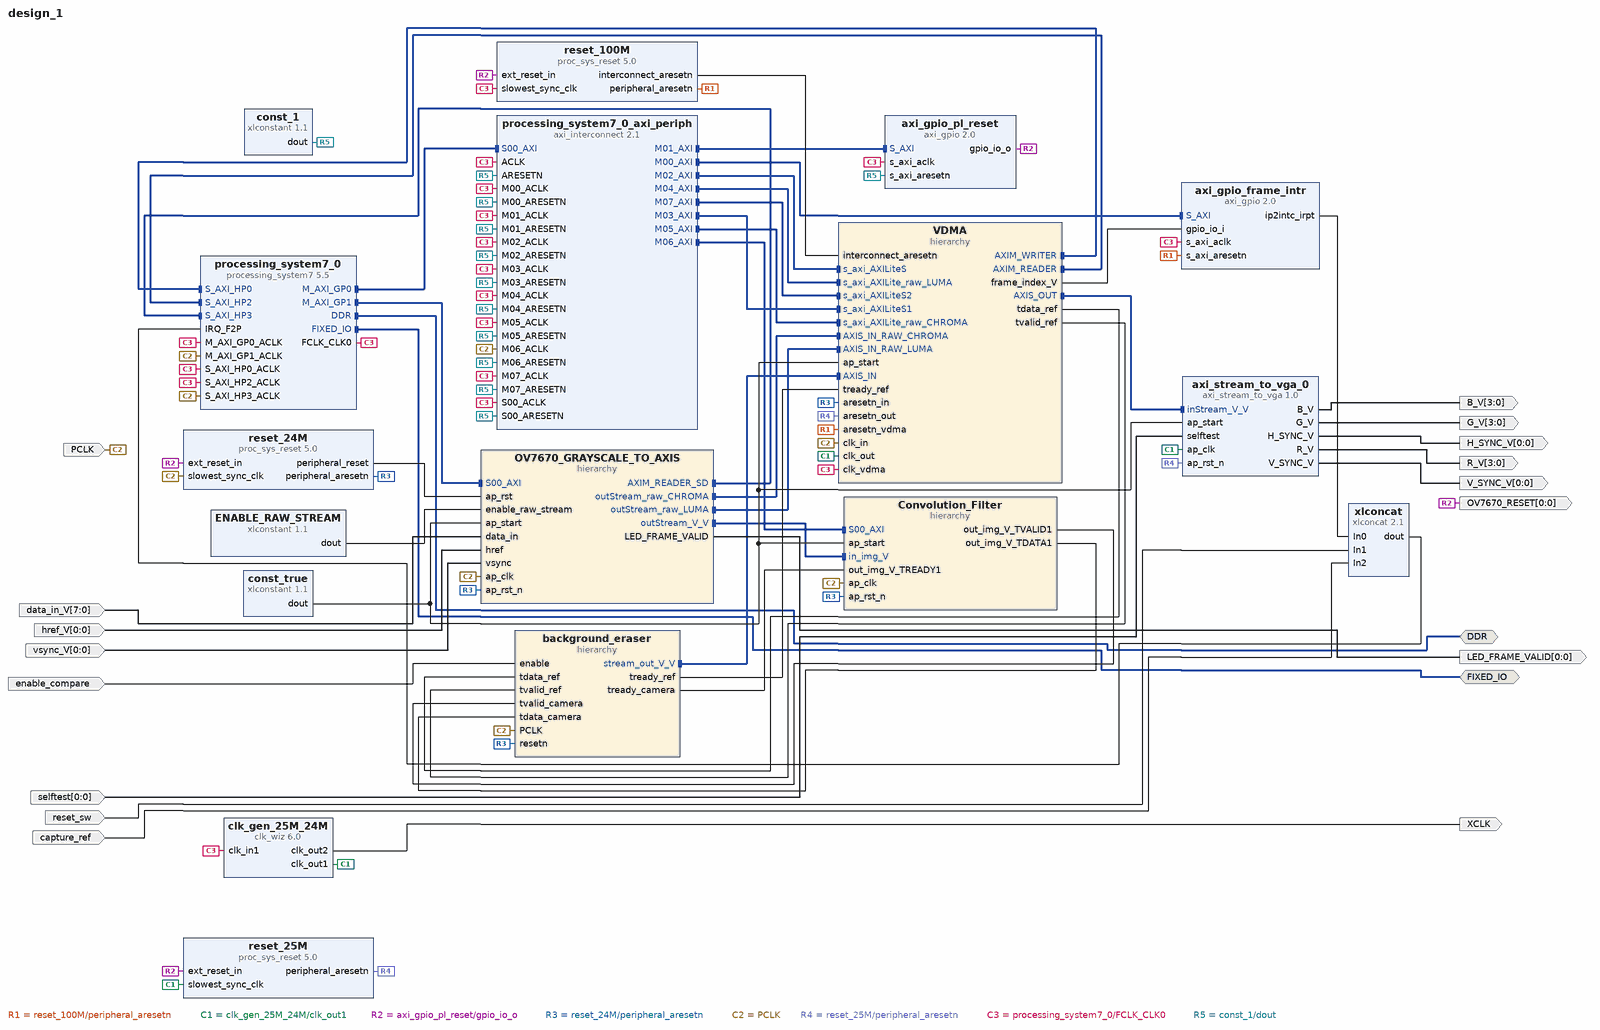
[diagram p0: block diagram of the top level]
# Vivado block design design_1, xc7z020clg484-1, Vivado 2019.1
create_bd_design design_1

create_bd_intf_port -mode Master -vlnv xilinx.com:interface:ddrx_rtl:1.0 DDR
create_bd_intf_port -mode Master -vlnv xilinx.com:display_processing_system7:fixedio_rtl:1.0 FIXED_IO
create_bd_port -dir O -from 0 -to 0 -type rst OV7670_RESET
create_bd_port -dir O -type clk XCLK
create_bd_port -dir I -type clk PCLK
set_property -dict {CONFIG.FREQ_HZ 24000000} [get_bd_ports PCLK]
create_bd_port -dir O -from 3 -to 0 -type data R_V
create_bd_port -dir O -from 3 -to 0 -type data G_V
create_bd_port -dir O -from 3 -to 0 -type data B_V
create_bd_port -dir O -from 0 -to 0 -type data V_SYNC_V
create_bd_port -dir O -from 0 -to 0 -type data H_SYNC_V
create_bd_port -dir I -from 0 -to 0 -type data selftest
set_property -dict [list \
  CONFIG.LAYERED_METADATA {xilinx.com:interface:datatypes:1.0 {DATA {datatype {name {attribs {resolve_type immediate dependency {} format string minimum {} maximum {}} value {}} bitwidth {attribs {resolve_type immediate dependency {} format long minimum {} maximum {}} value 1} bitoffset {attribs {resolve_type immediate dependency {} format long minimum {} maximum {}} value 0}}}}} \
] [get_bd_ports selftest]
create_bd_port -dir I -from 7 -to 0 -type data data_in_V
set_property -dict [list \
  CONFIG.LAYERED_METADATA {xilinx.com:interface:datatypes:1.0 {DATA {datatype {name {attribs {resolve_type immediate dependency {} format string minimum {} maximum {}} value {}} bitwidth {attribs {resolve_type immediate dependency {} format long minimum {} maximum {}} value 8} bitoffset {attribs {resolve_type immediate dependency {} format long minimum {} maximum {}} value 0} integer {signed {attribs {resolve_type immediate dependency {} format bool minimum {} maximum {}} value false}}}}}} \
] [get_bd_ports data_in_V]
create_bd_port -dir I -from 0 -to 0 -type data href_V
set_property -dict [list \
  CONFIG.LAYERED_METADATA {xilinx.com:interface:datatypes:1.0 {DATA {datatype {name {attribs {resolve_type immediate dependency {} format string minimum {} maximum {}} value {}} bitwidth {attribs {resolve_type immediate dependency {} format long minimum {} maximum {}} value 1} bitoffset {attribs {resolve_type immediate dependency {} format long minimum {} maximum {}} value 0} integer {signed {attribs {resolve_type immediate dependency {} format bool minimum {} maximum {}} value false}}}}}} \
] [get_bd_ports href_V]
create_bd_port -dir I -from 0 -to 0 -type data vsync_V
set_property -dict [list \
  CONFIG.LAYERED_METADATA {xilinx.com:interface:datatypes:1.0 {DATA {datatype {name {attribs {resolve_type immediate dependency {} format string minimum {} maximum {}} value {}} bitwidth {attribs {resolve_type immediate dependency {} format long minimum {} maximum {}} value 1} bitoffset {attribs {resolve_type immediate dependency {} format long minimum {} maximum {}} value 0} integer {signed {attribs {resolve_type immediate dependency {} format bool minimum {} maximum {}} value false}}}}}} \
] [get_bd_ports vsync_V]
create_bd_port -dir I -type intr reset_sw
create_bd_port -dir O -from 0 -to 0 -type data LED_FRAME_VALID
create_bd_port -dir I -type data enable_compare
create_bd_port -dir I -type intr capture_ref

create_bd_cell -type hier VDMA
create_bd_cell -type hier OV7670_GRAYSCALE_TO_AXIS
create_bd_cell -type ip -vlnv xilinx.com:hls:axi_stream_to_vga:1.0 axi_stream_to_vga_0
create_bd_cell -type hier Convolution_Filter
create_bd_cell -type ip -vlnv xilinx.com:ip:axi_gpio:2.0 axi_gpio_frame_intr
set_property -dict {CONFIG.C_ALL_INPUTS 1 CONFIG.C_GPIO_WIDTH 8 CONFIG.C_INTERRUPT_PRESENT 1} [get_bd_cells axi_gpio_frame_intr]
create_bd_cell -type ip -vlnv xilinx.com:ip:axi_gpio:2.0 axi_gpio_pl_reset
set_property -dict [list \
  CONFIG.C_ALL_OUTPUTS 1 \
  CONFIG.C_DOUT_DEFAULT 0x00000001 \
  CONFIG.C_GPIO_WIDTH 1 \
] [get_bd_cells axi_gpio_pl_reset]
create_bd_cell -type ip -vlnv xilinx.com:ip:clk_wiz:6.0 clk_gen_25M_24M
set_property -dict [list \
  CONFIG.CLKOUT1_JITTER 469.645 \
  CONFIG.CLKOUT1_PHASE_ERROR 476.991 \
  CONFIG.CLKOUT1_REQUESTED_OUT_FREQ 25.175 \
  CONFIG.CLKOUT2_JITTER 473.605 \
  CONFIG.CLKOUT2_PHASE_ERROR 476.991 \
  CONFIG.CLKOUT2_REQUESTED_OUT_FREQ 24 \
  CONFIG.CLKOUT2_USED true \
  CONFIG.MMCM_CLKFBOUT_MULT_F 53.750 \
  CONFIG.MMCM_CLKIN1_PERIOD 10.000 \
  CONFIG.MMCM_CLKIN2_PERIOD 10.000 \
  CONFIG.MMCM_CLKOUT0_DIVIDE_F 30.500 \
  CONFIG.MMCM_CLKOUT1_DIVIDE 32 \
  CONFIG.MMCM_DIVCLK_DIVIDE 7 \
  CONFIG.NUM_OUT_CLKS 2 \
  CONFIG.USE_LOCKED false \
  CONFIG.USE_RESET false \
] [get_bd_cells clk_gen_25M_24M]
create_bd_cell -type ip -vlnv xilinx.com:ip:proc_sys_reset:5.0 reset_25M
create_bd_cell -type ip -vlnv xilinx.com:ip:proc_sys_reset:5.0 reset_24M
create_bd_cell -type ip -vlnv xilinx.com:ip:processing_system7:5.5 processing_system7_0
set_property -dict [list \
  CONFIG.PCW_APU_PERIPHERAL_FREQMHZ 666.666667 \
  CONFIG.PCW_ENET0_ENET0_IO {MIO 16 .. 27} \
  CONFIG.PCW_ENET0_GRP_MDIO_ENABLE 1 \
  CONFIG.PCW_ENET0_GRP_MDIO_IO {MIO 52 .. 53} \
  CONFIG.PCW_ENET0_PERIPHERAL_ENABLE 1 \
  CONFIG.PCW_ENET0_RESET_ENABLE 0 \
  CONFIG.PCW_ENET_RESET_ENABLE 1 \
  CONFIG.PCW_ENET_RESET_SELECT {Share reset pin} \
  CONFIG.PCW_FPGA0_PERIPHERAL_FREQMHZ 100.000000 \
  CONFIG.PCW_FPGA1_PERIPHERAL_FREQMHZ 150.000000 \
  CONFIG.PCW_GP0_EN_MODIFIABLE_TXN 0 \
  CONFIG.PCW_GP1_EN_MODIFIABLE_TXN 0 \
  CONFIG.PCW_GPIO_MIO_GPIO_ENABLE 1 \
  CONFIG.PCW_GPIO_MIO_GPIO_IO MIO \
  CONFIG.PCW_I2C0_GRP_INT_ENABLE 0 \
  CONFIG.PCW_I2C0_I2C0_IO {MIO 10 .. 11} \
  CONFIG.PCW_I2C0_PERIPHERAL_ENABLE 1 \
  CONFIG.PCW_I2C_PERIPHERAL_FREQMHZ 111.111115 \
  CONFIG.PCW_I2C_RESET_ENABLE 1 \
  CONFIG.PCW_I2C_RESET_SELECT {Share reset pin} \
  CONFIG.PCW_IRQ_F2P_INTR 1 \
  CONFIG.PCW_PERIPHERAL_BOARD_PRESET part0 \
  CONFIG.PCW_PRESET_BANK1_VOLTAGE {LVCMOS 1.8V} \
  CONFIG.PCW_QSPI_GRP_SINGLE_SS_ENABLE 1 \
  CONFIG.PCW_QSPI_GRP_SINGLE_SS_IO {MIO 1 .. 6} \
  CONFIG.PCW_QSPI_PERIPHERAL_ENABLE 1 \
  CONFIG.PCW_QSPI_QSPI_IO {MIO 1 .. 6} \
  CONFIG.PCW_SD0_GRP_CD_ENABLE 1 \
  CONFIG.PCW_SD0_GRP_CD_IO {MIO 47} \
  CONFIG.PCW_SD0_GRP_WP_ENABLE 1 \
  CONFIG.PCW_SD0_GRP_WP_IO {MIO 46} \
  CONFIG.PCW_SD0_PERIPHERAL_ENABLE 1 \
  CONFIG.PCW_SD0_SD0_IO {MIO 40 .. 45} \
  CONFIG.PCW_SDIO_PERIPHERAL_FREQMHZ 50 \
  CONFIG.PCW_SINGLE_QSPI_DATA_MODE x4 \
  CONFIG.PCW_TTC0_PERIPHERAL_ENABLE 1 \
  CONFIG.PCW_TTC0_TTC0_IO EMIO \
  CONFIG.PCW_UART1_PERIPHERAL_ENABLE 1 \
  CONFIG.PCW_UART1_UART1_IO {MIO 48 .. 49} \
  CONFIG.PCW_UART_PERIPHERAL_FREQMHZ 50 \
  CONFIG.PCW_UIPARAM_DDR_FREQ_MHZ 533.333313 \
  CONFIG.PCW_UIPARAM_DDR_PARTNO {MT41J128M16 HA-15E} \
  CONFIG.PCW_USB0_PERIPHERAL_ENABLE 1 \
  CONFIG.PCW_USB0_RESET_ENABLE 0 \
  CONFIG.PCW_USB0_USB0_IO {MIO 28 .. 39} \
  CONFIG.PCW_USB_RESET_ENABLE 1 \
  CONFIG.PCW_USB_RESET_SELECT {Share reset pin} \
  CONFIG.PCW_USE_FABRIC_INTERRUPT 1 \
  CONFIG.PCW_USE_M_AXI_GP1 1 \
  CONFIG.PCW_USE_S_AXI_HP0 1 \
  CONFIG.PCW_USE_S_AXI_HP2 1 \
  CONFIG.PCW_USE_S_AXI_HP3 1 \
  CONFIG.preset ZedBoard \
] [get_bd_cells processing_system7_0]
# 536 more settings of processing_system7_0 are not shown: defaults, MIO pin electricals, DDR timing, and values the tool derives
create_bd_cell -type ip -vlnv xilinx.com:ip:axi_interconnect:2.1 processing_system7_0_axi_periph
set_property -dict {CONFIG.NUM_MI 8 CONFIG.SYNCHRONIZATION_STAGES 2} [get_bd_cells processing_system7_0_axi_periph]
create_bd_cell -type ip -vlnv xilinx.com:ip:proc_sys_reset:5.0 reset_100M
create_bd_cell -type ip -vlnv xilinx.com:ip:xlconcat:2.1 xlconcat
set_property -dict {CONFIG.NUM_PORTS 3} [get_bd_cells xlconcat]
create_bd_cell -type ip -vlnv xilinx.com:ip:xlconstant:1.1 const_true
create_bd_cell -type ip -vlnv xilinx.com:ip:xlconstant:1.1 const_1
create_bd_cell -type ip -vlnv xilinx.com:ip:xlconstant:1.1 ENABLE_RAW_STREAM
set_property -dict {CONFIG.CONST_VAL 1} [get_bd_cells ENABLE_RAW_STREAM]
create_bd_cell -type hier background_eraser

# ---- hierarchy /VDMA ----
current_bd_instance /VDMA
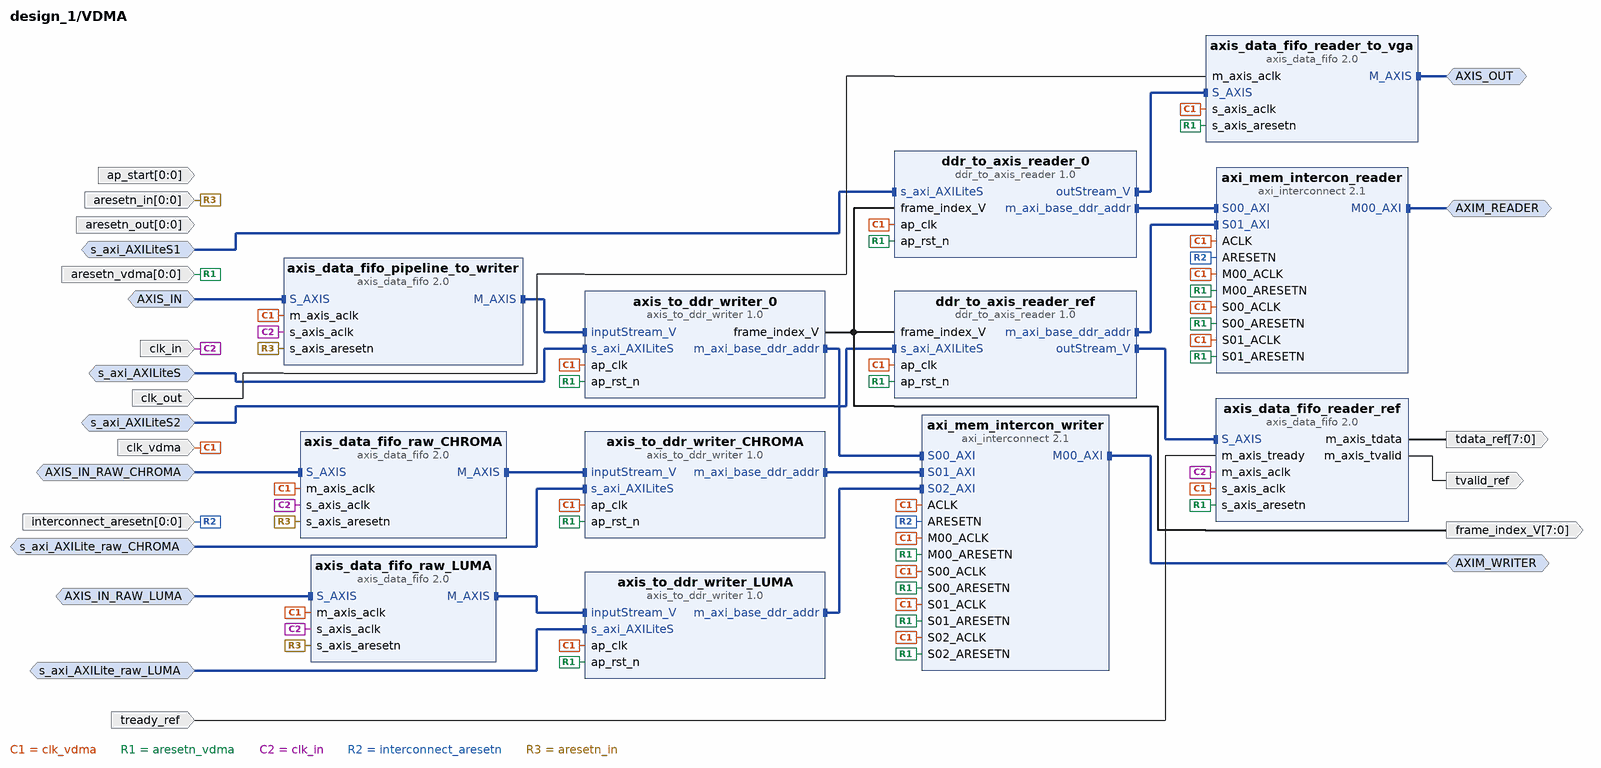
[diagram p1: block diagram inside /VDMA]
create_bd_intf_pin -mode Slave -vlnv xilinx.com:interface:axis_rtl:1.0 AXIS_IN
create_bd_intf_pin -mode Master -vlnv xilinx.com:interface:aximm_rtl:1.0 AXIM_READER
create_bd_intf_pin -mode Master -vlnv xilinx.com:interface:aximm_rtl:1.0 AXIM_WRITER
create_bd_intf_pin -mode Slave -vlnv xilinx.com:interface:aximm_rtl:1.0 s_axi_AXILiteS
create_bd_intf_pin -mode Slave -vlnv xilinx.com:interface:aximm_rtl:1.0 s_axi_AXILiteS1
create_bd_intf_pin -mode Slave -vlnv xilinx.com:interface:aximm_rtl:1.0 s_axi_AXILite_raw_LUMA
create_bd_intf_pin -mode Slave -vlnv xilinx.com:interface:aximm_rtl:1.0 s_axi_AXILite_raw_CHROMA
create_bd_intf_pin -mode Slave -vlnv xilinx.com:interface:axis_rtl:1.0 AXIS_IN_RAW_LUMA
create_bd_intf_pin -mode Slave -vlnv xilinx.com:interface:axis_rtl:1.0 AXIS_IN_RAW_CHROMA
create_bd_intf_pin -mode Master -vlnv xilinx.com:interface:axis_rtl:1.0 AXIS_OUT
create_bd_intf_pin -mode Slave -vlnv xilinx.com:interface:aximm_rtl:1.0 s_axi_AXILiteS2
create_bd_pin -dir I -type clk clk_vdma
create_bd_pin -dir I -from 0 -to 0 -type rst aresetn_vdma
create_bd_pin -dir I -from 0 -to 0 ap_start
create_bd_pin -dir I -from 0 -to 0 -type rst aresetn_in
create_bd_pin -dir I -type clk clk_in
create_bd_pin -dir I -from 0 -to 0 -type rst interconnect_aresetn
create_bd_pin -dir O -from 7 -to 0 -type data frame_index_V
create_bd_pin -dir I -type clk clk_out
create_bd_pin -dir I -from 0 -to 0 -type rst aresetn_out
create_bd_pin -dir O -from 7 -to 0 tdata_ref
create_bd_pin -dir O tvalid_ref
create_bd_pin -dir I tready_ref

create_bd_cell -type ip -vlnv xilinx.com:hls:ddr_to_axis_reader:1.0 ddr_to_axis_reader_0
create_bd_cell -type ip -vlnv xilinx.com:ip:axi_interconnect:2.1 axi_mem_intercon_writer
set_property -dict {CONFIG.NUM_MI 1 CONFIG.NUM_SI 3 CONFIG.SYNCHRONIZATION_STAGES 2} [get_bd_cells axi_mem_intercon_writer]
create_bd_cell -type ip -vlnv xilinx.com:ip:axi_interconnect:2.1 axi_mem_intercon_reader
set_property -dict {CONFIG.NUM_MI 1 CONFIG.NUM_SI 2 CONFIG.SYNCHRONIZATION_STAGES 2} [get_bd_cells axi_mem_intercon_reader]
create_bd_cell -type ip -vlnv xilinx.com:ip:axis_data_fifo:2.0 axis_data_fifo_reader_to_vga
set_property -dict [list \
  CONFIG.FIFO_DEPTH 1024 \
  CONFIG.HAS_RD_DATA_COUNT 1 \
  CONFIG.HAS_WR_DATA_COUNT 1 \
  CONFIG.IS_ACLK_ASYNC 1 \
  CONFIG.SYNCHRONIZATION_STAGES 2 \
] [get_bd_cells axis_data_fifo_reader_to_vga]
create_bd_cell -type ip -vlnv xilinx.com:ip:axis_data_fifo:2.0 axis_data_fifo_raw_LUMA
set_property -dict [list \
  CONFIG.FIFO_DEPTH 1024 \
  CONFIG.HAS_RD_DATA_COUNT 1 \
  CONFIG.HAS_WR_DATA_COUNT 1 \
  CONFIG.IS_ACLK_ASYNC 1 \
  CONFIG.SYNCHRONIZATION_STAGES 2 \
] [get_bd_cells axis_data_fifo_raw_LUMA]
create_bd_cell -type ip -vlnv xilinx.com:ip:axis_data_fifo:2.0 axis_data_fifo_pipeline_to_writer
set_property -dict [list \
  CONFIG.FIFO_DEPTH 1024 \
  CONFIG.HAS_RD_DATA_COUNT 1 \
  CONFIG.HAS_WR_DATA_COUNT 1 \
  CONFIG.IS_ACLK_ASYNC 1 \
  CONFIG.SYNCHRONIZATION_STAGES 2 \
] [get_bd_cells axis_data_fifo_pipeline_to_writer]
create_bd_cell -type ip -vlnv xilinx.com:ip:axis_data_fifo:2.0 axis_data_fifo_raw_CHROMA
set_property -dict [list \
  CONFIG.FIFO_DEPTH 1024 \
  CONFIG.HAS_RD_DATA_COUNT 1 \
  CONFIG.HAS_WR_DATA_COUNT 1 \
  CONFIG.IS_ACLK_ASYNC 1 \
  CONFIG.SYNCHRONIZATION_STAGES 2 \
] [get_bd_cells axis_data_fifo_raw_CHROMA]
create_bd_cell -type ip -vlnv xilinx.com:hls:ddr_to_axis_reader:1.0 ddr_to_axis_reader_ref
create_bd_cell -type ip -vlnv xilinx.com:ip:axis_data_fifo:2.0 axis_data_fifo_reader_ref
set_property -dict [list \
  CONFIG.FIFO_DEPTH 1024 \
  CONFIG.HAS_RD_DATA_COUNT 1 \
  CONFIG.HAS_WR_DATA_COUNT 1 \
  CONFIG.IS_ACLK_ASYNC 1 \
  CONFIG.SYNCHRONIZATION_STAGES 2 \
] [get_bd_cells axis_data_fifo_reader_ref]
create_bd_cell -type ip -vlnv xilinx.com:hls:axis_to_ddr_writer:1.0 axis_to_ddr_writer_0
create_bd_cell -type ip -vlnv xilinx.com:hls:axis_to_ddr_writer:1.0 axis_to_ddr_writer_CHROMA
create_bd_cell -type ip -vlnv xilinx.com:hls:axis_to_ddr_writer:1.0 axis_to_ddr_writer_LUMA

# ---- hierarchy /OV7670_GRAYSCALE_TO_AXIS ----
current_bd_instance /OV7670_GRAYSCALE_TO_AXIS
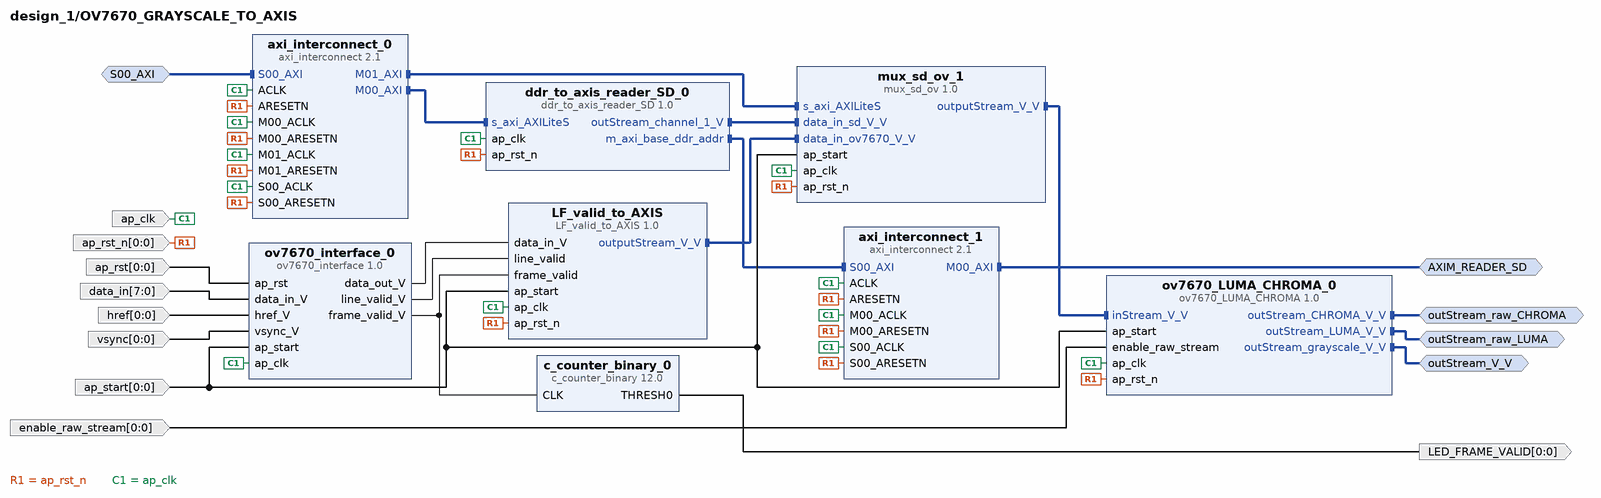
[diagram p2: block diagram inside /OV7670_GRAYSCALE_TO_AXIS]
create_bd_intf_pin -mode Master -vlnv xilinx.com:interface:axis_rtl:1.0 outStream_V_V
create_bd_intf_pin -mode Master -vlnv xilinx.com:interface:axis_rtl:1.0 outStream_raw_LUMA
create_bd_intf_pin -mode Master -vlnv xilinx.com:interface:axis_rtl:1.0 outStream_raw_CHROMA
create_bd_intf_pin -mode Slave -vlnv xilinx.com:interface:aximm_rtl:1.0 S00_AXI
create_bd_intf_pin -mode Master -vlnv xilinx.com:interface:aximm_rtl:1.0 AXIM_READER_SD
create_bd_pin -dir I -type clk ap_clk
create_bd_pin -dir I -from 0 -to 0 -type rst ap_rst_n
create_bd_pin -dir I -from 0 -to 0 ap_start
create_bd_pin -dir I -from 0 -to 0 -type rst ap_rst
create_bd_pin -dir I -from 7 -to 0 -type data data_in
create_bd_pin -dir I -from 0 -to 0 -type data href
create_bd_pin -dir I -from 0 -to 0 -type data vsync
create_bd_pin -dir O -from 0 -to 0 -type data LED_FRAME_VALID
create_bd_pin -dir I -from 0 -to 0 -type data enable_raw_stream

create_bd_cell -type ip -vlnv xilinx.com:hls:LF_valid_to_AXIS:1.0 LF_valid_to_AXIS
create_bd_cell -type ip -vlnv xilinx.com:hls:ov7670_LUMA_CHROMA:1.0 ov7670_LUMA_CHROMA_0
create_bd_cell -type ip -vlnv xilinx.com:hls:ov7670_interface:1.0 ov7670_interface_0
create_bd_cell -type ip -vlnv xilinx.com:hls:mux_sd_ov:1.0 mux_sd_ov_1
create_bd_cell -type ip -vlnv xilinx.com:hls:ddr_to_axis_reader_SD:1.0 ddr_to_axis_reader_SD_0
create_bd_cell -type ip -vlnv xilinx.com:ip:axi_interconnect:2.1 axi_interconnect_0
set_property -dict {CONFIG.NUM_MI 2 CONFIG.SYNCHRONIZATION_STAGES 2} [get_bd_cells axi_interconnect_0]
create_bd_cell -type ip -vlnv xilinx.com:ip:axi_interconnect:2.1 axi_interconnect_1
set_property -dict {CONFIG.NUM_MI 1 CONFIG.SYNCHRONIZATION_STAGES 2} [get_bd_cells axi_interconnect_1]
create_bd_cell -type ip -vlnv xilinx.com:ip:c_counter_binary:12.0 c_counter_binary_0
set_property -dict [list \
  CONFIG.Output_Width 4 \
  CONFIG.Restrict_Count false \
  CONFIG.Sync_Threshold_Output true \
  CONFIG.Threshold_Value F \
] [get_bd_cells c_counter_binary_0]

# ---- hierarchy /Convolution_Filter ----
current_bd_instance /Convolution_Filter
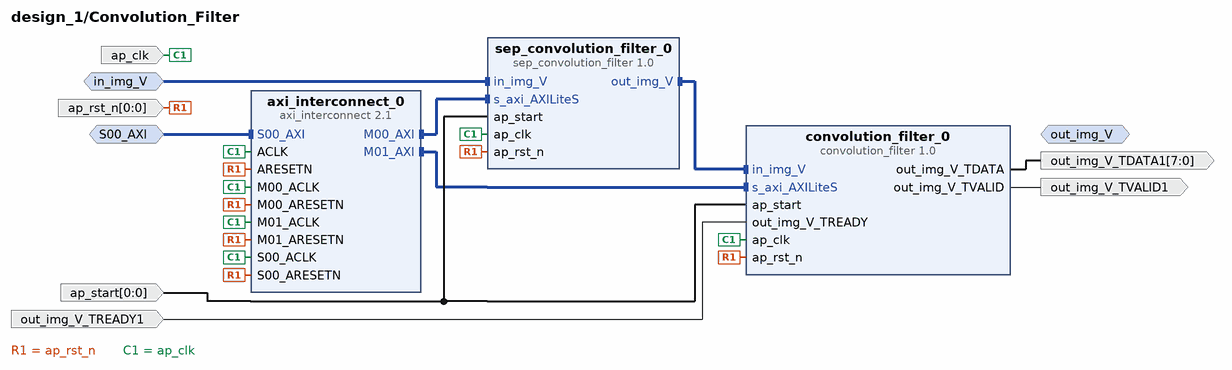
[diagram p3: block diagram inside /Convolution_Filter]
create_bd_intf_pin -mode Slave -vlnv xilinx.com:interface:axis_rtl:1.0 in_img_V
create_bd_intf_pin -mode Slave -vlnv xilinx.com:interface:aximm_rtl:1.0 S00_AXI
create_bd_intf_pin -mode Master -vlnv xilinx.com:interface:axis_rtl:1.0 out_img_V
create_bd_pin -dir I -from 0 -to 0 -type rst ap_rst_n
create_bd_pin -dir I -type clk ap_clk
create_bd_pin -dir I -from 0 -to 0 ap_start
create_bd_pin -dir O out_img_V_TVALID1
create_bd_pin -dir I out_img_V_TREADY1
create_bd_pin -dir O -from 7 -to 0 out_img_V_TDATA1

create_bd_cell -type ip -vlnv xilinx.com:hls:convolution_filter:1.0 convolution_filter_0
create_bd_cell -type ip -vlnv xilinx.com:hls:sep_convolution_filter:1.0 sep_convolution_filter_0
create_bd_cell -type ip -vlnv xilinx.com:ip:axi_interconnect:2.1 axi_interconnect_0
set_property -dict {CONFIG.SYNCHRONIZATION_STAGES 2} [get_bd_cells axi_interconnect_0]

# ---- hierarchy /background_eraser ----
current_bd_instance /background_eraser
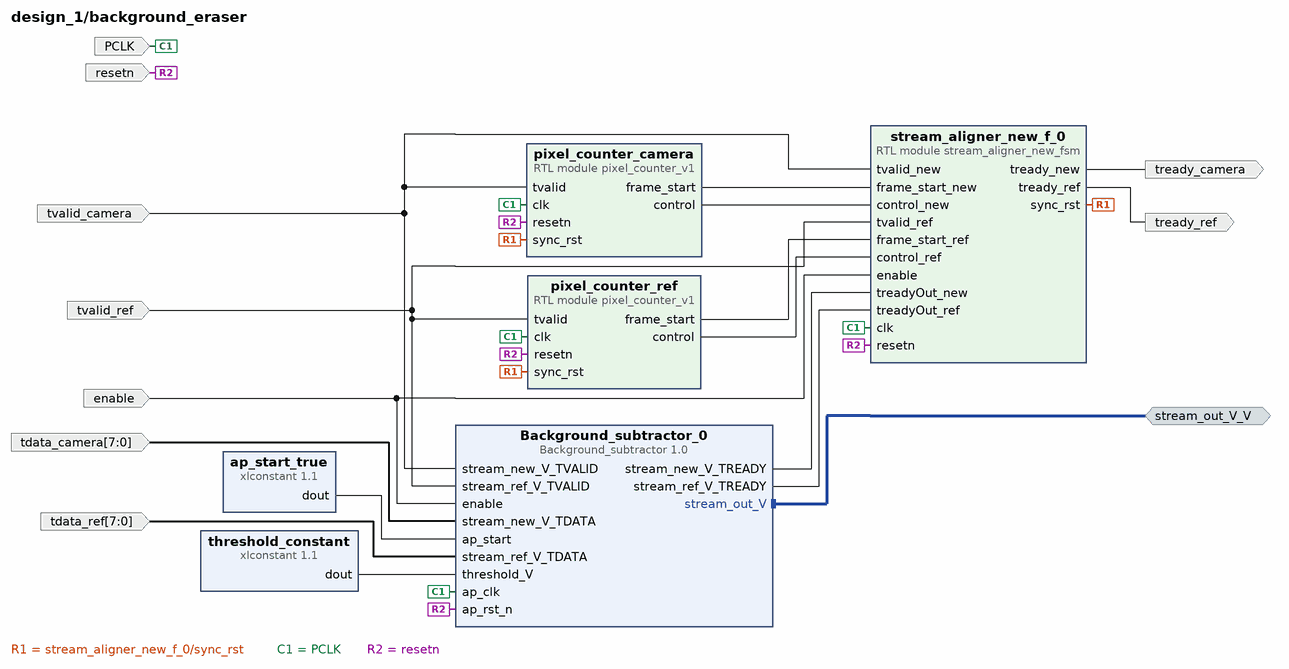
[diagram p4: block diagram inside /background_eraser]
create_bd_intf_pin -mode Master -vlnv xilinx.com:interface:axis_rtl:1.0 stream_out_V_V
create_bd_pin -dir I -type clk PCLK
create_bd_pin -dir I -type data enable
create_bd_pin -dir I tvalid_camera
create_bd_pin -dir O tready_camera
create_bd_pin -dir I -from 7 -to 0 tdata_camera
create_bd_pin -dir I tvalid_ref
create_bd_pin -dir O tready_ref
create_bd_pin -dir I -from 7 -to 0 tdata_ref
create_bd_pin -dir I -type rst resetn

create_bd_cell -type module -reference stream_aligner_new_fsm stream_aligner_new_f_0
create_bd_cell -type ip -vlnv xilinx.com:ip:xlconstant:1.1 ap_start_true
create_bd_cell -type ip -vlnv xilinx.com:hls:Background_subtractor:1.0 Background_subtractor_0
create_bd_cell -type ip -vlnv xilinx.com:ip:xlconstant:1.1 threshold_constant
set_property -dict {CONFIG.CONST_VAL 30 CONFIG.CONST_WIDTH 8} [get_bd_cells threshold_constant]
create_bd_cell -type module -reference pixel_counter_v1 pixel_counter_ref
create_bd_cell -type module -reference pixel_counter_v1 pixel_counter_camera

# ---- connections ----

current_bd_instance /VDMA
connect_bd_intf_net -intf_net axi_mem_intercon_M00_AXI [get_bd_intf_pins AXIM_WRITER] [get_bd_intf_pins axi_mem_intercon_writer/M00_AXI]
connect_bd_intf_net [get_bd_intf_pins AXIM_READER] [get_bd_intf_pins axi_mem_intercon_reader/M00_AXI]
connect_bd_intf_net [get_bd_intf_pins s_axi_AXILiteS2] [get_bd_intf_pins ddr_to_axis_reader_ref/s_axi_AXILiteS]
connect_bd_intf_net [get_bd_intf_pins ddr_to_axis_reader_ref/outStream_V] [get_bd_intf_pins axis_data_fifo_reader_ref/S_AXIS]
connect_bd_intf_net [get_bd_intf_pins ddr_to_axis_reader_0/m_axi_base_ddr_addr] [get_bd_intf_pins axi_mem_intercon_reader/S00_AXI]
connect_bd_intf_net [get_bd_intf_pins AXIS_OUT] [get_bd_intf_pins axis_data_fifo_reader_to_vga/M_AXIS]
connect_bd_intf_net [get_bd_intf_pins s_axi_AXILite_raw_CHROMA] [get_bd_intf_pins axis_to_ddr_writer_CHROMA/s_axi_AXILiteS]
connect_bd_intf_net [get_bd_intf_pins ddr_to_axis_reader_0/outStream_V] [get_bd_intf_pins axis_data_fifo_reader_to_vga/S_AXIS]
connect_bd_intf_net [get_bd_intf_pins axis_to_ddr_writer_0/m_axi_base_ddr_addr] [get_bd_intf_pins axi_mem_intercon_writer/S00_AXI]
connect_bd_intf_net [get_bd_intf_pins s_axi_AXILite_raw_LUMA] [get_bd_intf_pins axis_to_ddr_writer_LUMA/s_axi_AXILiteS]
connect_bd_intf_net [get_bd_intf_pins AXIS_IN_RAW_LUMA] [get_bd_intf_pins axis_data_fifo_raw_LUMA/S_AXIS]
connect_bd_intf_net [get_bd_intf_pins ddr_to_axis_reader_ref/m_axi_base_ddr_addr] [get_bd_intf_pins axi_mem_intercon_reader/S01_AXI]
connect_bd_intf_net [get_bd_intf_pins axi_mem_intercon_writer/S01_AXI] [get_bd_intf_pins axis_to_ddr_writer_CHROMA/m_axi_base_ddr_addr]
connect_bd_intf_net -intf_net axis_data_fifo_1_M_AXIS [get_bd_intf_pins axis_data_fifo_raw_CHROMA/M_AXIS] [get_bd_intf_pins axis_to_ddr_writer_CHROMA/inputStream_V]
connect_bd_intf_net -intf_net s_axi_AXILiteS1_1 [get_bd_intf_pins s_axi_AXILiteS1] [get_bd_intf_pins ddr_to_axis_reader_0/s_axi_AXILiteS]
connect_bd_intf_net [get_bd_intf_pins axis_to_ddr_writer_0/inputStream_V] [get_bd_intf_pins axis_data_fifo_pipeline_to_writer/M_AXIS]
connect_bd_intf_net [get_bd_intf_pins AXIS_IN_RAW_CHROMA] [get_bd_intf_pins axis_data_fifo_raw_CHROMA/S_AXIS]
connect_bd_intf_net -intf_net Filter_Convolution_0_out_img_V [get_bd_intf_pins AXIS_IN] [get_bd_intf_pins axis_data_fifo_pipeline_to_writer/S_AXIS]
connect_bd_intf_net [get_bd_intf_pins s_axi_AXILiteS] [get_bd_intf_pins axis_to_ddr_writer_0/s_axi_AXILiteS]
connect_bd_intf_net -intf_net axis_data_fifo_0_M_AXIS [get_bd_intf_pins axis_data_fifo_raw_LUMA/M_AXIS] [get_bd_intf_pins axis_to_ddr_writer_LUMA/inputStream_V]
connect_bd_intf_net [get_bd_intf_pins axi_mem_intercon_writer/S02_AXI] [get_bd_intf_pins axis_to_ddr_writer_LUMA/m_axi_base_ddr_addr]
connect_bd_net -net CLOCK_100M_1 [get_bd_pins clk_vdma] \
  [get_bd_pins ddr_to_axis_reader_0/ap_clk] [get_bd_pins axi_mem_intercon_writer/ACLK] \
  [get_bd_pins axi_mem_intercon_writer/S00_ACLK] [get_bd_pins axi_mem_intercon_writer/M00_ACLK] \
  [get_bd_pins axi_mem_intercon_writer/S01_ACLK] [get_bd_pins axi_mem_intercon_writer/S02_ACLK] \
  [get_bd_pins axi_mem_intercon_reader/ACLK] [get_bd_pins axi_mem_intercon_reader/S00_ACLK] \
  [get_bd_pins axi_mem_intercon_reader/M00_ACLK] [get_bd_pins axis_data_fifo_reader_to_vga/s_axis_aclk] \
  [get_bd_pins axis_data_fifo_raw_LUMA/m_axis_aclk] [get_bd_pins axis_data_fifo_pipeline_to_writer/m_axis_aclk] \
  [get_bd_pins axis_data_fifo_raw_CHROMA/m_axis_aclk] [get_bd_pins ddr_to_axis_reader_ref/ap_clk] \
  [get_bd_pins axis_data_fifo_reader_ref/s_axis_aclk] [get_bd_pins axi_mem_intercon_reader/S01_ACLK] \
  [get_bd_pins axis_to_ddr_writer_0/ap_clk] [get_bd_pins axis_to_ddr_writer_CHROMA/ap_clk] \
  [get_bd_pins axis_to_ddr_writer_LUMA/ap_clk]
connect_bd_net -net rst_processing_system7_0_100M_peripheral_aresetn [get_bd_pins aresetn_vdma] \
  [get_bd_pins ddr_to_axis_reader_0/ap_rst_n] [get_bd_pins axi_mem_intercon_writer/S00_ARESETN] \
  [get_bd_pins axi_mem_intercon_writer/M00_ARESETN] [get_bd_pins axi_mem_intercon_writer/S01_ARESETN] \
  [get_bd_pins axi_mem_intercon_writer/S02_ARESETN] [get_bd_pins axi_mem_intercon_reader/S00_ARESETN] \
  [get_bd_pins axi_mem_intercon_reader/M00_ARESETN] [get_bd_pins axis_data_fifo_reader_to_vga/s_axis_aresetn] \
  [get_bd_pins ddr_to_axis_reader_ref/ap_rst_n] [get_bd_pins axis_data_fifo_reader_ref/s_axis_aresetn] \
  [get_bd_pins axi_mem_intercon_reader/S01_ARESETN] [get_bd_pins axis_to_ddr_writer_0/ap_rst_n] \
  [get_bd_pins axis_to_ddr_writer_CHROMA/ap_rst_n] [get_bd_pins axis_to_ddr_writer_LUMA/ap_rst_n]
connect_bd_net -net PCLK_1 [get_bd_pins clk_in] \
  [get_bd_pins axis_data_fifo_raw_LUMA/s_axis_aclk] [get_bd_pins axis_data_fifo_pipeline_to_writer/s_axis_aclk] \
  [get_bd_pins axis_data_fifo_raw_CHROMA/s_axis_aclk] [get_bd_pins axis_data_fifo_reader_ref/m_axis_aclk]
connect_bd_net -net rst_processing_system7_0_100M_interconnect_aresetn [get_bd_pins interconnect_aresetn] \
  [get_bd_pins axi_mem_intercon_writer/ARESETN] [get_bd_pins axi_mem_intercon_reader/ARESETN]
connect_bd_net [get_bd_pins axis_to_ddr_writer_0/frame_index_V] \
  [get_bd_pins frame_index_V] [get_bd_pins ddr_to_axis_reader_0/frame_index_V] \
  [get_bd_pins ddr_to_axis_reader_ref/frame_index_V]
connect_bd_net [get_bd_pins aresetn_in] \
  [get_bd_pins axis_data_fifo_raw_LUMA/s_axis_aresetn] [get_bd_pins axis_data_fifo_pipeline_to_writer/s_axis_aresetn] \
  [get_bd_pins axis_data_fifo_raw_CHROMA/s_axis_aresetn]
connect_bd_net -net clk_wiz_0_clk_out1 [get_bd_pins clk_out] [get_bd_pins axis_data_fifo_reader_to_vga/m_axis_aclk]
# net aresetn_vga has one end: aresetn_out
connect_bd_net -net axis_data_fifo_reader_to_vga_1_m_axis_tdata [get_bd_pins axis_data_fifo_reader_ref/m_axis_tdata] [get_bd_pins tdata_ref]
connect_bd_net -net axis_data_fifo_reader_to_vga_1_m_axis_tvalid [get_bd_pins axis_data_fifo_reader_ref/m_axis_tvalid] [get_bd_pins tvalid_ref]
connect_bd_net -net m_axis_tready_1 [get_bd_pins tready_ref] [get_bd_pins axis_data_fifo_reader_ref/m_axis_tready]

current_bd_instance /OV7670_GRAYSCALE_TO_AXIS
connect_bd_intf_net [get_bd_intf_pins outStream_raw_LUMA] [get_bd_intf_pins ov7670_LUMA_CHROMA_0/outStream_LUMA_V_V]
connect_bd_intf_net [get_bd_intf_pins axi_interconnect_0/M00_AXI] [get_bd_intf_pins ddr_to_axis_reader_SD_0/s_axi_AXILiteS]
connect_bd_intf_net [get_bd_intf_pins axi_interconnect_0/M01_AXI] [get_bd_intf_pins mux_sd_ov_1/s_axi_AXILiteS]
connect_bd_intf_net [get_bd_intf_pins mux_sd_ov_1/outputStream_V_V] [get_bd_intf_pins ov7670_LUMA_CHROMA_0/inStream_V_V]
connect_bd_intf_net [get_bd_intf_pins outStream_raw_CHROMA] [get_bd_intf_pins ov7670_LUMA_CHROMA_0/outStream_CHROMA_V_V]
connect_bd_intf_net [get_bd_intf_pins ddr_to_axis_reader_SD_0/outStream_channel_1_V] [get_bd_intf_pins mux_sd_ov_1/data_in_sd_V_V]
connect_bd_intf_net [get_bd_intf_pins ddr_to_axis_reader_SD_0/m_axi_base_ddr_addr] [get_bd_intf_pins axi_interconnect_1/S00_AXI]
connect_bd_intf_net [get_bd_intf_pins S00_AXI] [get_bd_intf_pins axi_interconnect_0/S00_AXI]
connect_bd_intf_net [get_bd_intf_pins outStream_V_V] [get_bd_intf_pins ov7670_LUMA_CHROMA_0/outStream_grayscale_V_V]
connect_bd_intf_net [get_bd_intf_pins AXIM_READER_SD] [get_bd_intf_pins axi_interconnect_1/M00_AXI]
connect_bd_intf_net [get_bd_intf_pins LF_valid_to_AXIS/outputStream_V_V] [get_bd_intf_pins mux_sd_ov_1/data_in_ov7670_V_V]
connect_bd_net -net ov7670_interface_0_data_out_V [get_bd_pins ov7670_interface_0/data_out_V] [get_bd_pins LF_valid_to_AXIS/data_in_V]
connect_bd_net -net ov7670_interface_0_frame_valid_V [get_bd_pins ov7670_interface_0/frame_valid_V] \
  [get_bd_pins LF_valid_to_AXIS/frame_valid] [get_bd_pins c_counter_binary_0/CLK]
connect_bd_net -net ov7670_interface_0_line_valid_V [get_bd_pins ov7670_interface_0/line_valid_V] [get_bd_pins LF_valid_to_AXIS/line_valid]
connect_bd_net -net proc_sys_reset_0_peripheral_aresetn [get_bd_pins ap_rst_n] \
  [get_bd_pins LF_valid_to_AXIS/ap_rst_n] [get_bd_pins ov7670_LUMA_CHROMA_0/ap_rst_n] [get_bd_pins mux_sd_ov_1/ap_rst_n] \
  [get_bd_pins ddr_to_axis_reader_SD_0/ap_rst_n] [get_bd_pins axi_interconnect_0/ARESETN] \
  [get_bd_pins axi_interconnect_0/S00_ARESETN] [get_bd_pins axi_interconnect_0/M00_ARESETN] \
  [get_bd_pins axi_interconnect_0/M01_ARESETN] [get_bd_pins axi_interconnect_1/ARESETN] \
  [get_bd_pins axi_interconnect_1/S00_ARESETN] [get_bd_pins axi_interconnect_1/M00_ARESETN]
connect_bd_net [get_bd_pins ap_start] \
  [get_bd_pins ov7670_LUMA_CHROMA_0/ap_start] [get_bd_pins ov7670_interface_0/ap_start] \
  [get_bd_pins LF_valid_to_AXIS/ap_start] [get_bd_pins mux_sd_ov_1/ap_start]
connect_bd_net -net reset_24M_peripheral_reset [get_bd_pins ap_rst] [get_bd_pins ov7670_interface_0/ap_rst]
connect_bd_net -net data_in_V_1 [get_bd_pins data_in] [get_bd_pins ov7670_interface_0/data_in_V]
connect_bd_net -net href_V_1 [get_bd_pins href] [get_bd_pins ov7670_interface_0/href_V]
connect_bd_net -net vsync_V_1 [get_bd_pins vsync] [get_bd_pins ov7670_interface_0/vsync_V]
connect_bd_net [get_bd_pins c_counter_binary_0/THRESH0] [get_bd_pins LED_FRAME_VALID]
connect_bd_net -net PCLK_1 [get_bd_pins ap_clk] \
  [get_bd_pins LF_valid_to_AXIS/ap_clk] [get_bd_pins ov7670_LUMA_CHROMA_0/ap_clk] [get_bd_pins ov7670_interface_0/ap_clk] \
  [get_bd_pins mux_sd_ov_1/ap_clk] [get_bd_pins ddr_to_axis_reader_SD_0/ap_clk] [get_bd_pins axi_interconnect_0/ACLK] \
  [get_bd_pins axi_interconnect_0/S00_ACLK] [get_bd_pins axi_interconnect_0/M00_ACLK] \
  [get_bd_pins axi_interconnect_0/M01_ACLK] [get_bd_pins axi_interconnect_1/ACLK] [get_bd_pins axi_interconnect_1/S00_ACLK] \
  [get_bd_pins axi_interconnect_1/M00_ACLK]
connect_bd_net [get_bd_pins enable_raw_stream] [get_bd_pins ov7670_LUMA_CHROMA_0/enable_raw_stream]
set_property HDL_ATTRIBUTE.DEBUG_IN_BD true [get_bd_nets ov7670_interface_0_data_out_V]
set_property HDL_ATTRIBUTE.MARK_DEBUG true [get_bd_nets ov7670_interface_0_data_out_V]
set_property HDL_ATTRIBUTE.DEBUG_IN_BD true [get_bd_nets ov7670_interface_0_frame_valid_V]
set_property HDL_ATTRIBUTE.MARK_DEBUG true [get_bd_nets ov7670_interface_0_frame_valid_V]
set_property HDL_ATTRIBUTE.DEBUG_IN_BD true [get_bd_nets ov7670_interface_0_line_valid_V]
set_property HDL_ATTRIBUTE.MARK_DEBUG true [get_bd_nets ov7670_interface_0_line_valid_V]

current_bd_instance /Convolution_Filter
connect_bd_intf_net [get_bd_intf_pins in_img_V] [get_bd_intf_pins sep_convolution_filter_0/in_img_V]
connect_bd_intf_net [get_bd_intf_pins axi_interconnect_0/M01_AXI] [get_bd_intf_pins convolution_filter_0/s_axi_AXILiteS]
connect_bd_intf_net [get_bd_intf_pins axi_interconnect_0/M00_AXI] [get_bd_intf_pins sep_convolution_filter_0/s_axi_AXILiteS]
connect_bd_intf_net [get_bd_intf_pins sep_convolution_filter_0/out_img_V] [get_bd_intf_pins convolution_filter_0/in_img_V]
connect_bd_intf_net [get_bd_intf_pins S00_AXI] [get_bd_intf_pins axi_interconnect_0/S00_AXI]
connect_bd_net -net ARESETN_1 [get_bd_pins ap_rst_n] \
  [get_bd_pins sep_convolution_filter_0/ap_rst_n] [get_bd_pins convolution_filter_0/ap_rst_n] \
  [get_bd_pins axi_interconnect_0/ARESETN] [get_bd_pins axi_interconnect_0/S00_ARESETN] \
  [get_bd_pins axi_interconnect_0/M00_ARESETN] [get_bd_pins axi_interconnect_0/M01_ARESETN]
connect_bd_net -net M00_ACLK_1 [get_bd_pins ap_clk] \
  [get_bd_pins sep_convolution_filter_0/ap_clk] [get_bd_pins convolution_filter_0/ap_clk] \
  [get_bd_pins axi_interconnect_0/ACLK] [get_bd_pins axi_interconnect_0/S00_ACLK] [get_bd_pins axi_interconnect_0/M00_ACLK] \
  [get_bd_pins axi_interconnect_0/M01_ACLK]
connect_bd_net [get_bd_pins ap_start] [get_bd_pins sep_convolution_filter_0/ap_start] [get_bd_pins convolution_filter_0/ap_start]
connect_bd_net [get_bd_pins convolution_filter_0/out_img_V_TVALID] [get_bd_pins out_img_V_TVALID1]
connect_bd_net -net out_img_V_TREADY1_1 [get_bd_pins out_img_V_TREADY1] [get_bd_pins convolution_filter_0/out_img_V_TREADY]
connect_bd_net [get_bd_pins convolution_filter_0/out_img_V_TDATA] [get_bd_pins out_img_V_TDATA1]

current_bd_instance /background_eraser
connect_bd_intf_net [get_bd_intf_pins stream_out_V_V] [get_bd_intf_pins Background_subtractor_0/stream_out_V]
connect_bd_net [get_bd_pins stream_aligner_new_f_0/sync_rst] [get_bd_pins pixel_counter_ref/sync_rst] [get_bd_pins pixel_counter_camera/sync_rst]
connect_bd_net [get_bd_pins PCLK] \
  [get_bd_pins stream_aligner_new_f_0/clk] [get_bd_pins Background_subtractor_0/ap_clk] [get_bd_pins pixel_counter_ref/clk] \
  [get_bd_pins pixel_counter_camera/clk]
connect_bd_net [get_bd_pins resetn] \
  [get_bd_pins stream_aligner_new_f_0/resetn] [get_bd_pins Background_subtractor_0/ap_rst_n] \
  [get_bd_pins pixel_counter_ref/resetn] [get_bd_pins pixel_counter_camera/resetn]
connect_bd_net -net xlconstant_0_dout [get_bd_pins ap_start_true/dout] [get_bd_pins Background_subtractor_0/ap_start]
connect_bd_net -net enable_0_1 [get_bd_pins enable] [get_bd_pins stream_aligner_new_f_0/enable] [get_bd_pins Background_subtractor_0/enable]
connect_bd_net -net Background_subtractor_0_stream_new_V_V_TREADY [get_bd_pins Background_subtractor_0/stream_new_V_TREADY] \
  [get_bd_pins stream_aligner_new_f_0/treadyOut_new]
connect_bd_net -net Background_subtractor_0_stream_ref_V_V_TREADY [get_bd_pins Background_subtractor_0/stream_ref_V_TREADY] \
  [get_bd_pins stream_aligner_new_f_0/treadyOut_ref]
connect_bd_net [get_bd_pins tvalid_camera] \
  [get_bd_pins stream_aligner_new_f_0/tvalid_new] [get_bd_pins Background_subtractor_0/stream_new_V_TVALID] \
  [get_bd_pins pixel_counter_camera/tvalid]
connect_bd_net [get_bd_pins tvalid_ref] \
  [get_bd_pins stream_aligner_new_f_0/tvalid_ref] [get_bd_pins Background_subtractor_0/stream_ref_V_TVALID] \
  [get_bd_pins pixel_counter_ref/tvalid]
connect_bd_net [get_bd_pins pixel_counter_camera/frame_start] [get_bd_pins stream_aligner_new_f_0/frame_start_new]
connect_bd_net [get_bd_pins pixel_counter_ref/frame_start] [get_bd_pins stream_aligner_new_f_0/frame_start_ref]
connect_bd_net [get_bd_pins pixel_counter_camera/control] [get_bd_pins stream_aligner_new_f_0/control_new]
connect_bd_net [get_bd_pins pixel_counter_ref/control] [get_bd_pins stream_aligner_new_f_0/control_ref]
connect_bd_net [get_bd_pins stream_aligner_new_f_0/tready_new] [get_bd_pins tready_camera]
connect_bd_net -net stream_new_V_V_TDATA_1 [get_bd_pins tdata_camera] [get_bd_pins Background_subtractor_0/stream_new_V_TDATA]
connect_bd_net [get_bd_pins stream_aligner_new_f_0/tready_ref] [get_bd_pins tready_ref]
connect_bd_net -net stream_ref_V_V_TDATA_1 [get_bd_pins tdata_ref] [get_bd_pins Background_subtractor_0/stream_ref_V_TDATA]
connect_bd_net -net xlconstant_0_dout1 [get_bd_pins threshold_constant/dout] [get_bd_pins Background_subtractor_0/threshold_V]

current_bd_instance /
connect_bd_intf_net [get_bd_intf_pins OV7670_GRAYSCALE_TO_AXIS/outStream_raw_CHROMA] [get_bd_intf_pins VDMA/AXIS_IN_RAW_CHROMA]
connect_bd_intf_net [get_bd_intf_ports DDR] [get_bd_intf_pins processing_system7_0/DDR]
connect_bd_intf_net [get_bd_intf_pins VDMA/AXIS_OUT] [get_bd_intf_pins axi_stream_to_vga_0/inStream_V_V]
connect_bd_intf_net -intf_net axi_mem_intercon_M00_AXI [get_bd_intf_pins VDMA/AXIM_WRITER] [get_bd_intf_pins processing_system7_0/S_AXI_HP0]
connect_bd_intf_net [get_bd_intf_pins VDMA/AXIS_IN] [get_bd_intf_pins background_eraser/stream_out_V_V]
connect_bd_intf_net [get_bd_intf_pins processing_system7_0_axi_periph/M02_AXI] [get_bd_intf_pins VDMA/s_axi_AXILiteS]
connect_bd_intf_net [get_bd_intf_pins processing_system7_0_axi_periph/M04_AXI] [get_bd_intf_pins VDMA/s_axi_AXILite_raw_LUMA]
connect_bd_intf_net [get_bd_intf_pins processing_system7_0_axi_periph/M07_AXI] [get_bd_intf_pins VDMA/s_axi_AXILiteS2]
connect_bd_intf_net [get_bd_intf_ports FIXED_IO] [get_bd_intf_pins processing_system7_0/FIXED_IO]
connect_bd_intf_net [get_bd_intf_pins OV7670_GRAYSCALE_TO_AXIS/outStream_raw_LUMA] [get_bd_intf_pins VDMA/AXIS_IN_RAW_LUMA]
connect_bd_intf_net [get_bd_intf_pins processing_system7_0_axi_periph/M06_AXI] [get_bd_intf_pins Convolution_Filter/S00_AXI]
connect_bd_intf_net [get_bd_intf_pins OV7670_GRAYSCALE_TO_AXIS/AXIM_READER_SD] [get_bd_intf_pins processing_system7_0/S_AXI_HP3]
connect_bd_intf_net [get_bd_intf_pins processing_system7_0_axi_periph/M01_AXI] [get_bd_intf_pins axi_gpio_pl_reset/S_AXI]
connect_bd_intf_net [get_bd_intf_pins processing_system7_0_axi_periph/M03_AXI] [get_bd_intf_pins VDMA/s_axi_AXILiteS1]
connect_bd_intf_net -intf_net axi_mem_intercon_reader_M00_AXI [get_bd_intf_pins VDMA/AXIM_READER] [get_bd_intf_pins processing_system7_0/S_AXI_HP2]
connect_bd_intf_net [get_bd_intf_pins processing_system7_0/M_AXI_GP1] [get_bd_intf_pins OV7670_GRAYSCALE_TO_AXIS/S00_AXI]
connect_bd_intf_net [get_bd_intf_pins processing_system7_0_axi_periph/M00_AXI] [get_bd_intf_pins axi_gpio_frame_intr/S_AXI]
connect_bd_intf_net [get_bd_intf_pins processing_system7_0/M_AXI_GP0] [get_bd_intf_pins processing_system7_0_axi_periph/S00_AXI]
connect_bd_intf_net [get_bd_intf_pins processing_system7_0_axi_periph/M05_AXI] [get_bd_intf_pins VDMA/s_axi_AXILite_raw_CHROMA]
connect_bd_intf_net [get_bd_intf_pins OV7670_GRAYSCALE_TO_AXIS/outStream_V_V] [get_bd_intf_pins Convolution_Filter/in_img_V]
connect_bd_net -net ap_start_1 [get_bd_pins const_true/dout] \
  [get_bd_pins axi_stream_to_vga_0/ap_start] [get_bd_pins VDMA/ap_start] [get_bd_pins OV7670_GRAYSCALE_TO_AXIS/ap_start] \
  [get_bd_pins Convolution_Filter/ap_start]
connect_bd_net -net rst_processing_system7_0_100M_peripheral_aresetn [get_bd_pins reset_100M/peripheral_aresetn] \
  [get_bd_pins VDMA/aresetn_vdma] [get_bd_pins axi_gpio_frame_intr/s_axi_aresetn]
connect_bd_net -net rst_processing_system7_0_100M_interconnect_aresetn [get_bd_pins reset_100M/interconnect_aresetn] \
  [get_bd_pins VDMA/interconnect_aresetn]
connect_bd_net -net clk_wiz_0_clk_out1 [get_bd_pins clk_gen_25M_24M/clk_out1] \
  [get_bd_pins axi_stream_to_vga_0/ap_clk] [get_bd_pins VDMA/clk_out] [get_bd_pins reset_25M/slowest_sync_clk]
connect_bd_net -net ext_reset_in_1 [get_bd_pins axi_gpio_pl_reset/gpio_io_o] \
  [get_bd_ports OV7670_RESET] [get_bd_pins reset_25M/ext_reset_in] [get_bd_pins reset_24M/ext_reset_in] \
  [get_bd_pins reset_100M/ext_reset_in]
connect_bd_net -net clk_gen_25M_23M_clk_out2 [get_bd_pins clk_gen_25M_24M/clk_out2] [get_bd_ports XCLK]
connect_bd_net -net proc_sys_reset_0_peripheral_aresetn [get_bd_pins reset_24M/peripheral_aresetn] \
  [get_bd_pins VDMA/aresetn_in] [get_bd_pins OV7670_GRAYSCALE_TO_AXIS/ap_rst_n] [get_bd_pins Convolution_Filter/ap_rst_n] \
  [get_bd_pins background_eraser/resetn]
connect_bd_net [get_bd_ports PCLK] \
  [get_bd_pins VDMA/clk_in] [get_bd_pins OV7670_GRAYSCALE_TO_AXIS/ap_clk] [get_bd_pins Convolution_Filter/ap_clk] \
  [get_bd_pins reset_24M/slowest_sync_clk] [get_bd_pins processing_system7_0/M_AXI_GP1_ACLK] \
  [get_bd_pins processing_system7_0/S_AXI_HP3_ACLK] [get_bd_pins processing_system7_0_axi_periph/M06_ACLK] \
  [get_bd_pins background_eraser/PCLK]
connect_bd_net -net axi_stream_to_vga_0_R_V [get_bd_pins axi_stream_to_vga_0/R_V] [get_bd_ports R_V]
connect_bd_net -net axi_stream_to_vga_0_G_V [get_bd_pins axi_stream_to_vga_0/G_V] [get_bd_ports G_V]
connect_bd_net -net axi_stream_to_vga_0_B_V [get_bd_pins axi_stream_to_vga_0/B_V] [get_bd_ports B_V]
connect_bd_net -net axi_stream_to_vga_0_V_SYNC_V [get_bd_pins axi_stream_to_vga_0/V_SYNC_V] [get_bd_ports V_SYNC_V]
connect_bd_net -net axi_stream_to_vga_0_H_SYNC_V [get_bd_pins axi_stream_to_vga_0/H_SYNC_V] [get_bd_ports H_SYNC_V]
connect_bd_net -net selftest_1 [get_bd_ports selftest] [get_bd_pins axi_stream_to_vga_0/selftest]
connect_bd_net [get_bd_pins reset_25M/peripheral_aresetn] [get_bd_pins axi_stream_to_vga_0/ap_rst_n] [get_bd_pins VDMA/aresetn_out]
connect_bd_net -net CLOCK_100M_1 [get_bd_pins processing_system7_0/FCLK_CLK0] \
  [get_bd_pins VDMA/clk_vdma] [get_bd_pins axi_gpio_frame_intr/s_axi_aclk] [get_bd_pins axi_gpio_pl_reset/s_axi_aclk] \
  [get_bd_pins clk_gen_25M_24M/clk_in1] [get_bd_pins processing_system7_0/M_AXI_GP0_ACLK] \
  [get_bd_pins processing_system7_0/S_AXI_HP0_ACLK] [get_bd_pins processing_system7_0/S_AXI_HP2_ACLK] \
  [get_bd_pins processing_system7_0_axi_periph/ACLK] [get_bd_pins processing_system7_0_axi_periph/S00_ACLK] \
  [get_bd_pins processing_system7_0_axi_periph/M00_ACLK] [get_bd_pins processing_system7_0_axi_periph/M01_ACLK] \
  [get_bd_pins processing_system7_0_axi_periph/M02_ACLK] [get_bd_pins processing_system7_0_axi_periph/M03_ACLK] \
  [get_bd_pins processing_system7_0_axi_periph/M04_ACLK] [get_bd_pins processing_system7_0_axi_periph/M05_ACLK] \
  [get_bd_pins reset_100M/slowest_sync_clk] [get_bd_pins processing_system7_0_axi_periph/M07_ACLK]
connect_bd_net -net data_in_V_1 [get_bd_ports data_in_V] [get_bd_pins OV7670_GRAYSCALE_TO_AXIS/data_in]
connect_bd_net -net href_V_1 [get_bd_ports href_V] [get_bd_pins OV7670_GRAYSCALE_TO_AXIS/href]
connect_bd_net -net vsync_V_1 [get_bd_ports vsync_V] [get_bd_pins OV7670_GRAYSCALE_TO_AXIS/vsync]
connect_bd_net [get_bd_pins reset_24M/peripheral_reset] [get_bd_pins OV7670_GRAYSCALE_TO_AXIS/ap_rst]
connect_bd_net -net axis_to_ddr_writer_0_frame_index_V [get_bd_pins VDMA/frame_index_V] [get_bd_pins axi_gpio_frame_intr/gpio_io_i]
connect_bd_net [get_bd_pins axi_gpio_frame_intr/ip2intc_irpt] [get_bd_pins xlconcat/In0]
connect_bd_net -net xlconcat_0_dout [get_bd_pins xlconcat/dout] [get_bd_pins processing_system7_0/IRQ_F2P]
connect_bd_net [get_bd_ports reset_sw] [get_bd_pins xlconcat/In1]
connect_bd_net -net OV7670_GRAYSCALE_TO_AXIS_Q [get_bd_pins OV7670_GRAYSCALE_TO_AXIS/LED_FRAME_VALID] [get_bd_ports LED_FRAME_VALID]
connect_bd_net [get_bd_pins ENABLE_RAW_STREAM/dout] [get_bd_pins OV7670_GRAYSCALE_TO_AXIS/enable_raw_stream]
connect_bd_net -net xlconstant_0_dout [get_bd_pins const_1/dout] \
  [get_bd_pins axi_gpio_pl_reset/s_axi_aresetn] [get_bd_pins processing_system7_0_axi_periph/ARESETN] \
  [get_bd_pins processing_system7_0_axi_periph/S00_ARESETN] [get_bd_pins processing_system7_0_axi_periph/M00_ARESETN] \
  [get_bd_pins processing_system7_0_axi_periph/M01_ARESETN] [get_bd_pins processing_system7_0_axi_periph/M02_ARESETN] \
  [get_bd_pins processing_system7_0_axi_periph/M03_ARESETN] [get_bd_pins processing_system7_0_axi_periph/M04_ARESETN] \
  [get_bd_pins processing_system7_0_axi_periph/M05_ARESETN] [get_bd_pins processing_system7_0_axi_periph/M06_ARESETN] \
  [get_bd_pins processing_system7_0_axi_periph/M07_ARESETN]
connect_bd_net -net enable_0_1 [get_bd_ports enable_compare] [get_bd_pins background_eraser/enable]
connect_bd_net [get_bd_pins Convolution_Filter/out_img_V_TVALID1] [get_bd_pins background_eraser/tvalid_camera]
connect_bd_net -net out_img_V_TREADY1_1 [get_bd_pins background_eraser/tready_camera] [get_bd_pins Convolution_Filter/out_img_V_TREADY1]
connect_bd_net [get_bd_pins Convolution_Filter/out_img_V_TDATA1] [get_bd_pins background_eraser/tdata_camera]
connect_bd_net [get_bd_ports capture_ref] [get_bd_pins xlconcat/In2]
connect_bd_net -net tdata_ref_1 [get_bd_pins VDMA/tdata_ref] [get_bd_pins background_eraser/tdata_ref]
connect_bd_net -net tvalid_ref_1 [get_bd_pins VDMA/tvalid_ref] [get_bd_pins background_eraser/tvalid_ref]
connect_bd_net [get_bd_pins background_eraser/tready_ref] [get_bd_pins VDMA/tready_ref]
set_property HDL_ATTRIBUTE.DEBUG_IN_BD true [get_bd_nets ext_reset_in_1]
set_property HDL_ATTRIBUTE.MARK_DEBUG true [get_bd_nets ext_reset_in_1]
set_property HDL_ATTRIBUTE.DEBUG_IN_BD true [get_bd_nets axi_stream_to_vga_0_R_V]
set_property HDL_ATTRIBUTE.MARK_DEBUG true [get_bd_nets axi_stream_to_vga_0_R_V]
set_property HDL_ATTRIBUTE.DEBUG_IN_BD true [get_bd_nets axi_stream_to_vga_0_G_V]
set_property HDL_ATTRIBUTE.MARK_DEBUG true [get_bd_nets axi_stream_to_vga_0_G_V]
set_property HDL_ATTRIBUTE.DEBUG_IN_BD true [get_bd_nets axi_stream_to_vga_0_B_V]
set_property HDL_ATTRIBUTE.MARK_DEBUG true [get_bd_nets axi_stream_to_vga_0_B_V]
set_property HDL_ATTRIBUTE.DEBUG_IN_BD true [get_bd_nets axi_stream_to_vga_0_V_SYNC_V]
set_property HDL_ATTRIBUTE.MARK_DEBUG true [get_bd_nets axi_stream_to_vga_0_V_SYNC_V]
set_property HDL_ATTRIBUTE.DEBUG_IN_BD true [get_bd_nets axi_stream_to_vga_0_H_SYNC_V]
set_property HDL_ATTRIBUTE.MARK_DEBUG true [get_bd_nets axi_stream_to_vga_0_H_SYNC_V]
set_property HDL_ATTRIBUTE.DEBUG_IN_BD true [get_bd_nets selftest_1]
set_property HDL_ATTRIBUTE.MARK_DEBUG true [get_bd_nets selftest_1]
set_property HDL_ATTRIBUTE.DEBUG_IN_BD true [get_bd_nets data_in_V_1]
set_property HDL_ATTRIBUTE.MARK_DEBUG true [get_bd_nets data_in_V_1]
set_property HDL_ATTRIBUTE.DEBUG_IN_BD true [get_bd_nets href_V_1]
set_property HDL_ATTRIBUTE.MARK_DEBUG true [get_bd_nets href_V_1]
set_property HDL_ATTRIBUTE.DEBUG_IN_BD true [get_bd_nets vsync_V_1]
set_property HDL_ATTRIBUTE.MARK_DEBUG true [get_bd_nets vsync_V_1]
set_property HDL_ATTRIBUTE.DEBUG_IN_BD true [get_bd_nets axis_to_ddr_writer_0_frame_index_V]
set_property HDL_ATTRIBUTE.MARK_DEBUG true [get_bd_nets axis_to_ddr_writer_0_frame_index_V]

# ---- address map ----
assign_bd_address -offset 0x00000000 -range 512M -target_address_space [get_bd_addr_spaces OV7670_GRAYSCALE_TO_AXIS/ddr_to_axis_reader_SD_0/Data_m_axi_base_ddr_addr] [get_bd_addr_segs processing_system7_0/S_AXI_HP3/HP3_DDR_LOWOCM]
assign_bd_address -offset 0x41200000 -range 64K -target_address_space [get_bd_addr_spaces processing_system7_0/Data] [get_bd_addr_segs axi_gpio_frame_intr/S_AXI/Reg]
assign_bd_address -offset 0x41210000 -range 64K -target_address_space [get_bd_addr_spaces processing_system7_0/Data] [get_bd_addr_segs axi_gpio_pl_reset/S_AXI/Reg]
assign_bd_address -offset 0x43C00000 -range 64K -target_address_space [get_bd_addr_spaces processing_system7_0/Data] [get_bd_addr_segs VDMA/axis_to_ddr_writer_0/s_axi_AXILiteS/Reg]
assign_bd_address -offset 0x43C10000 -range 64K -target_address_space [get_bd_addr_spaces processing_system7_0/Data] [get_bd_addr_segs VDMA/ddr_to_axis_reader_0/s_axi_AXILiteS/Reg]
assign_bd_address -offset 0x43C20000 -range 64K -target_address_space [get_bd_addr_spaces processing_system7_0/Data] [get_bd_addr_segs VDMA/axis_to_ddr_writer_CHROMA/s_axi_AXILiteS/Reg]
assign_bd_address -offset 0x43C30000 -range 64K -target_address_space [get_bd_addr_spaces processing_system7_0/Data] [get_bd_addr_segs VDMA/axis_to_ddr_writer_LUMA/s_axi_AXILiteS/Reg]
assign_bd_address -offset 0x43C40000 -range 64K -target_address_space [get_bd_addr_spaces processing_system7_0/Data] [get_bd_addr_segs Convolution_Filter/convolution_filter_0/s_axi_AXILiteS/Reg]
assign_bd_address -offset 0x43C50000 -range 64K -target_address_space [get_bd_addr_spaces processing_system7_0/Data] [get_bd_addr_segs Convolution_Filter/sep_convolution_filter_0/s_axi_AXILiteS/Reg]
assign_bd_address -offset 0x43C60000 -range 64K -target_address_space [get_bd_addr_spaces processing_system7_0/Data] [get_bd_addr_segs VDMA/ddr_to_axis_reader_ref/s_axi_AXILiteS/Reg]
assign_bd_address -offset 0x83C00000 -range 64K -target_address_space [get_bd_addr_spaces processing_system7_0/Data] [get_bd_addr_segs OV7670_GRAYSCALE_TO_AXIS/ddr_to_axis_reader_SD_0/s_axi_AXILiteS/Reg]
assign_bd_address -offset 0x83C10000 -range 64K -target_address_space [get_bd_addr_spaces processing_system7_0/Data] [get_bd_addr_segs OV7670_GRAYSCALE_TO_AXIS/mux_sd_ov_1/s_axi_AXILiteS/Reg]
assign_bd_address -offset 0x00000000 -range 512M -target_address_space [get_bd_addr_spaces VDMA/axis_to_ddr_writer_0/Data_m_axi_base_ddr_addr] [get_bd_addr_segs processing_system7_0/S_AXI_HP0/HP0_DDR_LOWOCM]
assign_bd_address -offset 0x00000000 -range 512M -target_address_space [get_bd_addr_spaces VDMA/axis_to_ddr_writer_CHROMA/Data_m_axi_base_ddr_addr] [get_bd_addr_segs processing_system7_0/S_AXI_HP0/HP0_DDR_LOWOCM]
assign_bd_address -offset 0x00000000 -range 512M -target_address_space [get_bd_addr_spaces VDMA/axis_to_ddr_writer_LUMA/Data_m_axi_base_ddr_addr] [get_bd_addr_segs processing_system7_0/S_AXI_HP0/HP0_DDR_LOWOCM]
assign_bd_address -offset 0x00000000 -range 512M -target_address_space [get_bd_addr_spaces VDMA/ddr_to_axis_reader_0/Data_m_axi_base_ddr_addr] [get_bd_addr_segs processing_system7_0/S_AXI_HP2/HP2_DDR_LOWOCM]
assign_bd_address -offset 0x00000000 -range 512M -target_address_space [get_bd_addr_spaces VDMA/ddr_to_axis_reader_ref/Data_m_axi_base_ddr_addr] [get_bd_addr_segs processing_system7_0/S_AXI_HP2/HP2_DDR_LOWOCM]

validate_bd_design
save_bd_design
